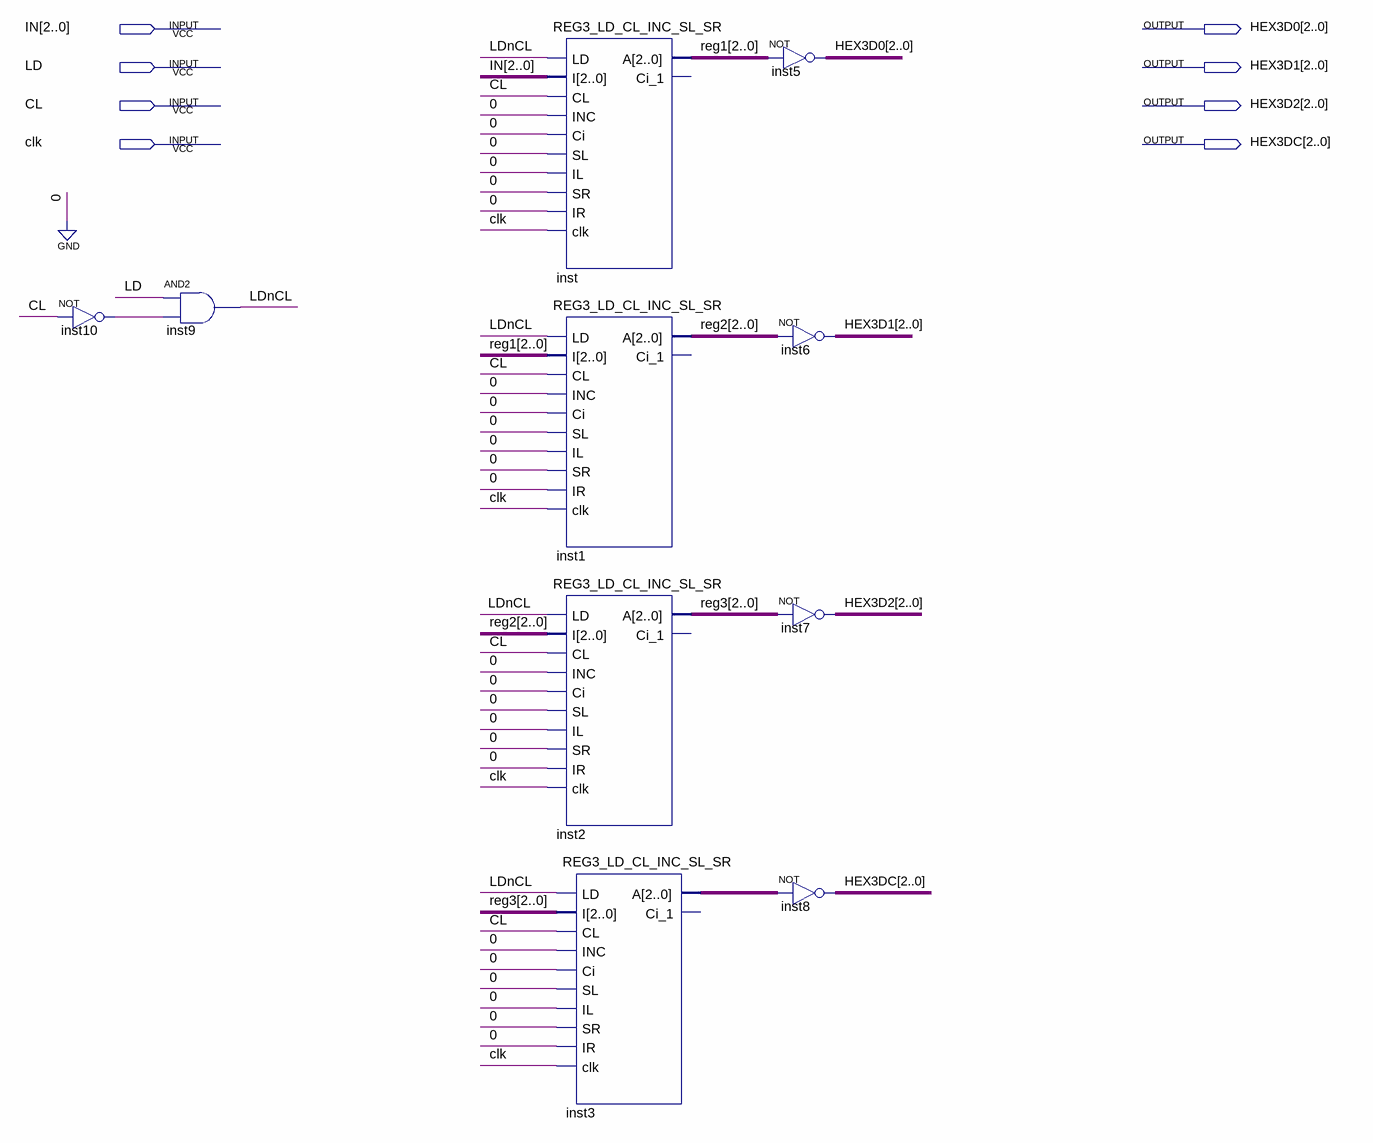
[diagram p0: schematic sheet]
// Quartus schematic main3.bdf as structural Verilog: 10 symbols, 8 pins
module main3 (
  input  [2:0] IN,
  input  LD,
  input  CL,
  input  clk,
  output [2:0] HEX3D0,
  output [2:0] HEX3D1,
  output [2:0] HEX3D2,
  output [2:0] HEX3DC
);

  wire inst10_out, LDnCL;
  wire [2:0] inst3_a, reg1, reg2, reg3;

  not inst10 (inst10_out, CL);
  and inst9 (LDnCL, LD, inst10_out);
  REG3_LD_CL_INC_SL_SR inst (
    .LD(LDnCL), .I(IN), .CL(CL), .INC(1'b0), .Ci(1'b0), .SL(1'b0), .IL(1'b0), .SR(1'b0), .IR(1'b0),
    .clk(clk), .A(reg1));  // open: Ci_1
  REG3_LD_CL_INC_SL_SR inst1 (
    .LD(LDnCL), .I(reg1), .CL(CL), .INC(1'b0), .Ci(1'b0), .SL(1'b0), .IL(1'b0), .SR(1'b0), .IR(1'b0),
    .clk(clk), .A(reg2));  // open: Ci_1
  REG3_LD_CL_INC_SL_SR inst2 (
    .LD(LDnCL), .I(reg2), .CL(CL), .INC(1'b0), .Ci(1'b0), .SL(1'b0), .IL(1'b0), .SR(1'b0), .IR(1'b0),
    .clk(clk), .A(reg3));  // open: Ci_1
  REG3_LD_CL_INC_SL_SR inst3 (
    .LD(LDnCL), .I(reg3), .CL(CL), .INC(1'b0), .Ci(1'b0), .SL(1'b0), .IL(1'b0), .SR(1'b0), .IR(1'b0),
    .clk(clk), .A(inst3_a));  // open: Ci_1
  assign HEX3D0 = ~reg1;  // NOT inst5, 3 bits wide
  assign HEX3D1 = ~reg2;  // NOT inst6, 3 bits wide
  assign HEX3D2 = ~reg3;  // NOT inst7, 3 bits wide
  assign HEX3DC = ~inst3_a;  // NOT inst8, 3 bits wide
endmodule
